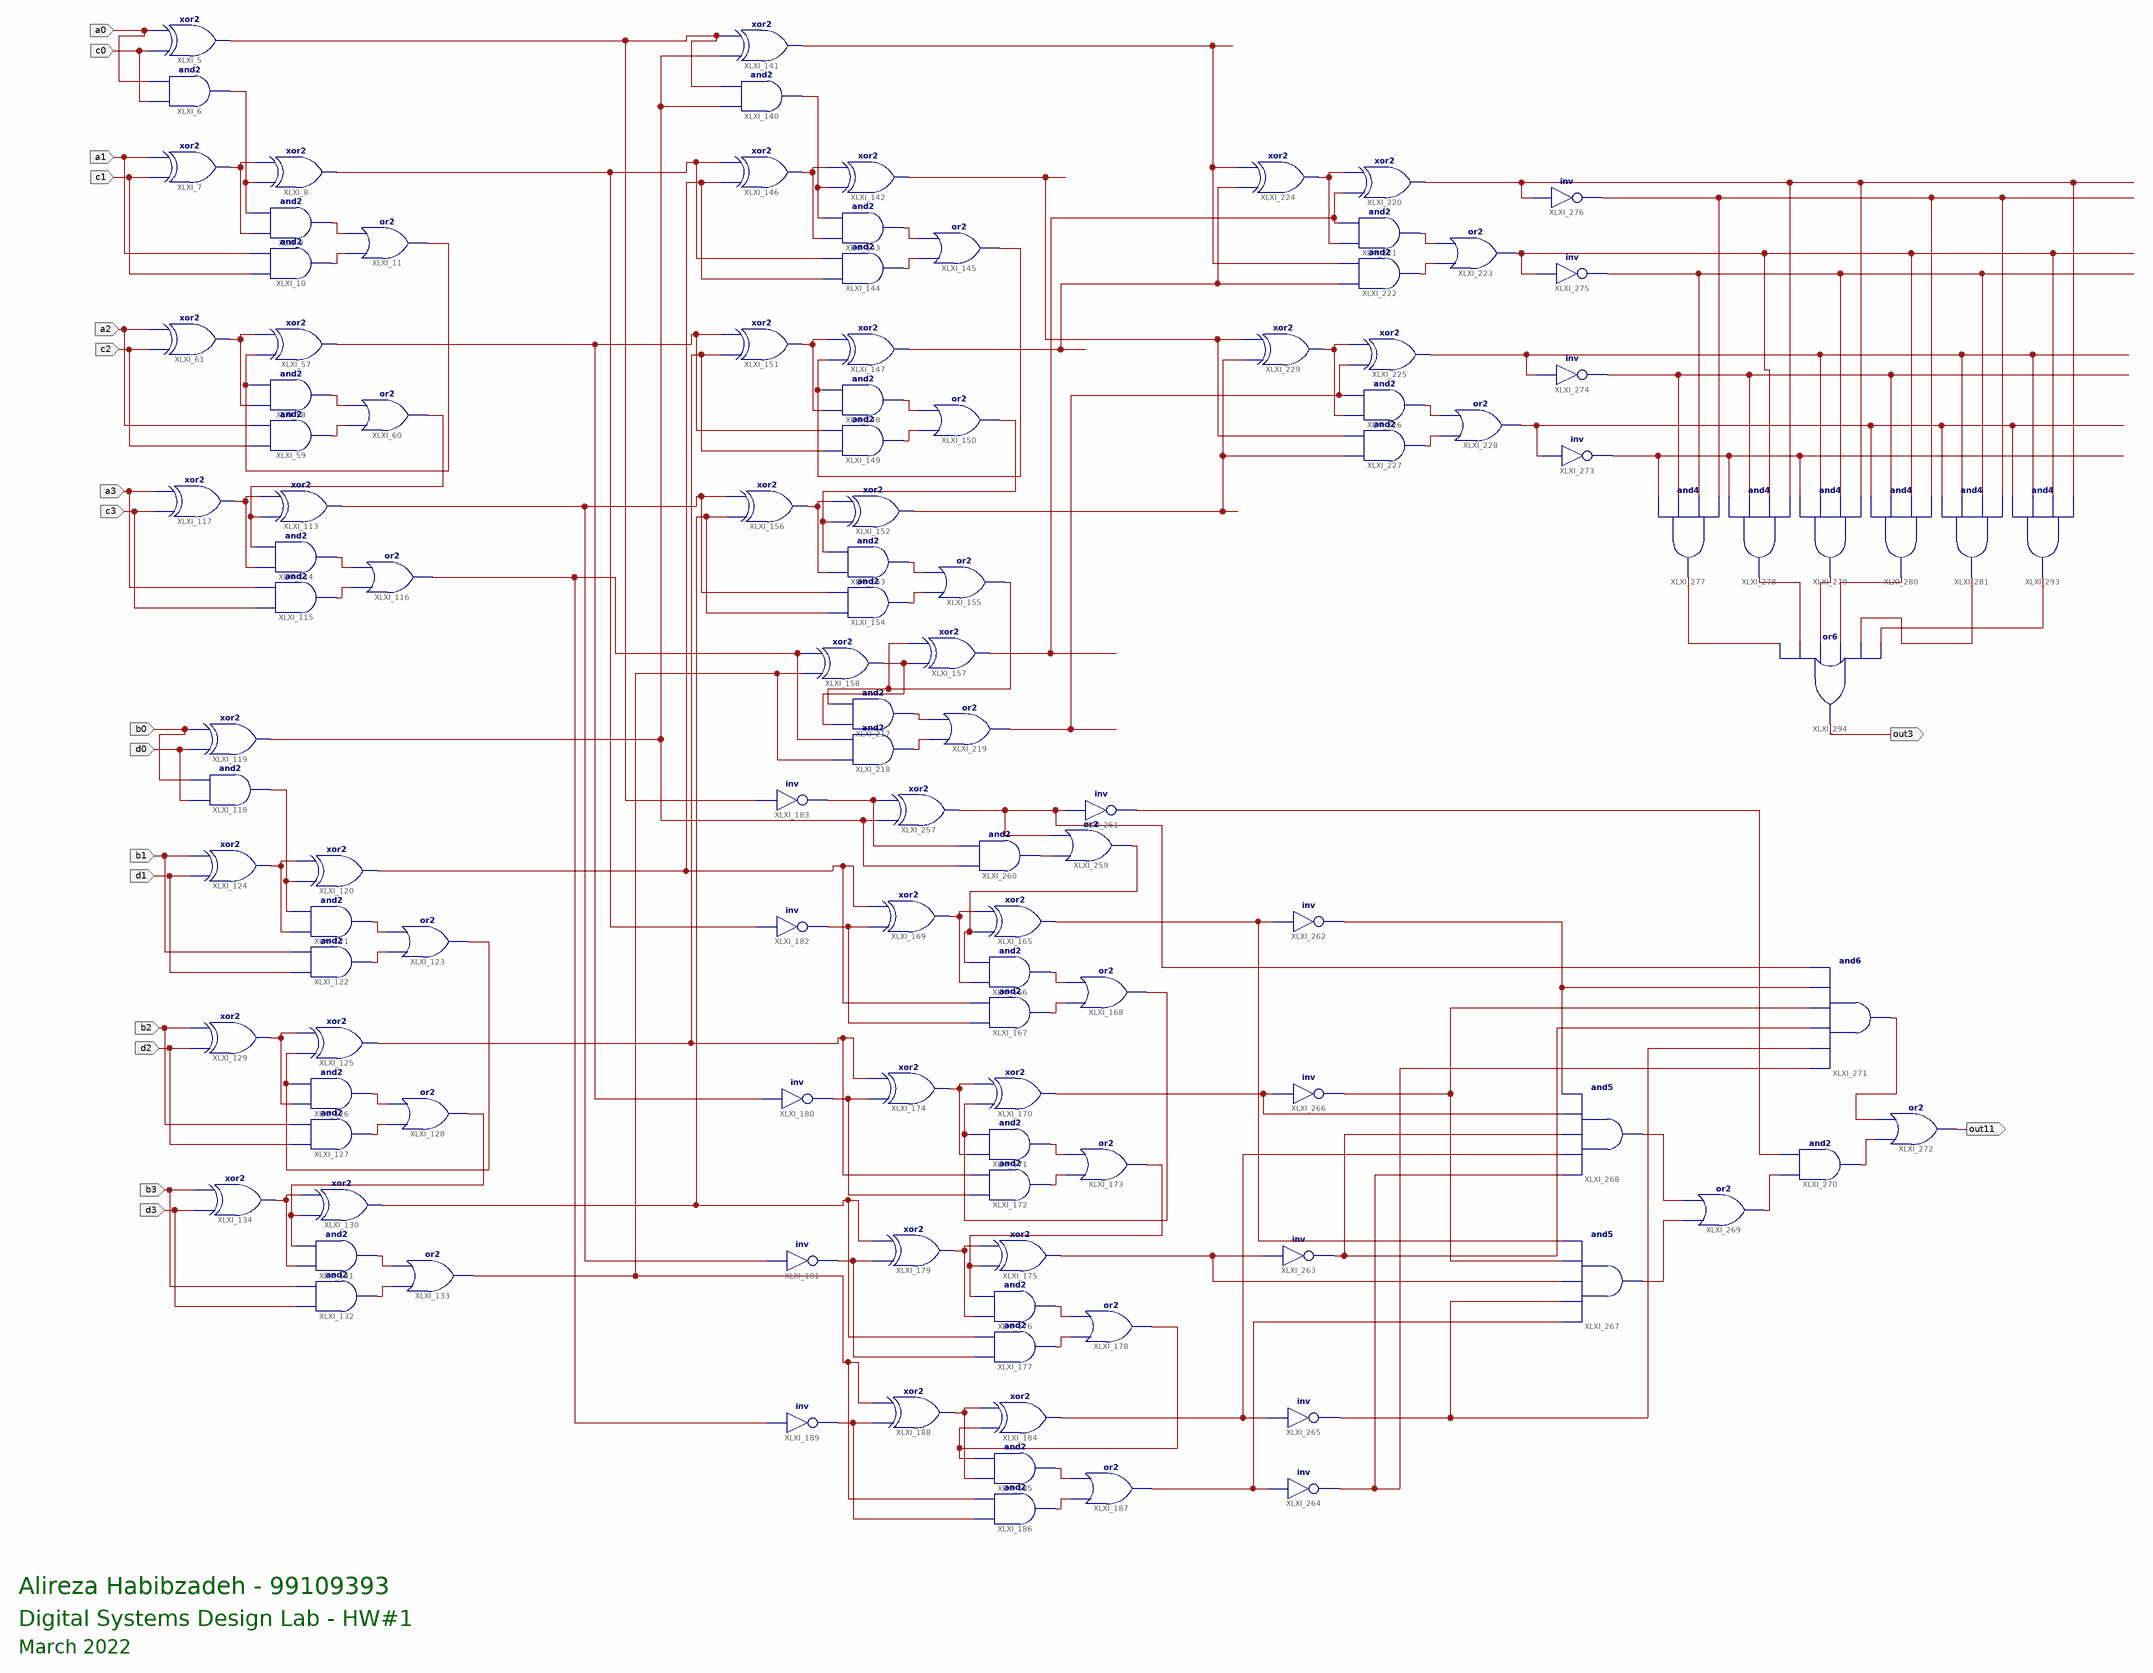
[diagram p0: schematic sheet 1]
// Xilinx ISE schematic bcd311.sch (spartan3) as structural Verilog: 117 symbols, 18 ports
module bcd311 (
  input  a0,
  input  c0,
  input  a1,
  input  c1,
  input  a2,
  input  c2,
  input  a3,
  input  c3,
  input  b0,
  input  d0,
  input  b1,
  input  d1,
  input  b2,
  input  d2,
  input  b3,
  input  d3,
  output out11,
  output out3
);

  wire s0, s1, s2, s3, s4, s5, XLXN_6, XLXN_7, XLXN_12, XLXN_13, XLXN_69, XLXN_71, XLXN_72, XLXN_74,
       XLXN_163, XLXN_165, XLXN_167, XLXN_170, XLXN_173, XLXN_175, XLXN_177, XLXN_178, XLXN_180, XLXN_182,
       XLXN_184, XLXN_189, XLXN_190, XLXN_192, XLXN_194, XLXN_198, XLXN_208, XLXN_210, XLXN_212, XLXN_213,
       XLXN_215, XLXN_217, XLXN_219, XLXN_221, XLXN_223, XLXN_224, XLXN_225, XLXN_227, XLXN_229, XLXN_231,
       XLXN_233, XLXN_247, XLXN_249, XLXN_251, XLXN_252, XLXN_254, XLXN_256, XLXN_258, XLXN_260, XLXN_262,
       XLXN_264, XLXN_266, XLXN_268, XLXN_270, XLXN_272, XLXN_273, XLXN_275, XLXN_277, XLXN_279, XLXN_280,
       XLXN_283, XLXN_284, XLXN_285, XLXN_286, XLXN_331, XLXN_332, XLXN_333, XLXN_334, XLXN_335, XLXN_336,
       XLXN_337, XLXN_339, XLXN_341, XLXN_345, XLXN_347, XLXN_349, XLXN_410, XLXN_411, XLXN_412, XLXN_417,
       XLXN_419, XLXN_420, XLXN_421, XLXN_422, XLXN_424, XLXN_426, XLXN_429, XLXN_432, XLXN_437, XLXN_441,
       XLXN_442, XLXN_444, XLXN_445, XLXN_446, XLXN_448, XLXN_449, XLXN_450, XLXN_838, XLXN_839, XLXN_840,
       XLXN_841, XLXN_849, XLXN_850, XLXN_851, XLXN_852, XLXN_855, XLXN_856, XLXN_857, XLXN_858, XLXN_867;

  and XLXI_6 (XLXN_12, c0, a0);
  xor XLXI_5 (XLXN_283, c0, a0);
  xor XLXI_8 (XLXN_284, XLXN_12, XLXN_13);
  and XLXI_9 (XLXN_6, XLXN_13, XLXN_12);
  and XLXI_10 (XLXN_7, c1, a1);
  or XLXI_11 (XLXN_72, XLXN_7, XLXN_6);
  xor XLXI_7 (XLXN_13, c1, a1);
  xor XLXI_57 (XLXN_285, XLXN_72, XLXN_74);
  and XLXI_58 (XLXN_69, XLXN_74, XLXN_72);
  and XLXI_59 (XLXN_71, c2, a2);
  or XLXI_60 (XLXN_170, XLXN_71, XLXN_69);
  xor XLXI_61 (XLXN_74, c2, a2);
  xor XLXI_113 (XLXN_286, XLXN_170, XLXN_167);
  and XLXI_114 (XLXN_163, XLXN_167, XLXN_170);
  and XLXI_115 (XLXN_165, c3, a3);
  or XLXI_116 (XLXN_335, XLXN_165, XLXN_163);
  xor XLXI_117 (XLXN_167, c3, a3);
  and XLXI_118 (XLXN_189, d0, b0);
  xor XLXI_119 (XLXN_411, d0, b0);
  xor XLXI_120 (XLXN_221, XLXN_189, XLXN_177);
  and XLXI_121 (XLXN_173, XLXN_177, XLXN_189);
  and XLXI_122 (XLXN_175, d1, b1);
  or XLXI_123 (XLXN_182, XLXN_175, XLXN_173);
  xor XLXI_124 (XLXN_177, d1, b1);
  xor XLXI_125 (XLXN_223, XLXN_182, XLXN_184);
  and XLXI_126 (XLXN_178, XLXN_184, XLXN_182);
  and XLXI_127 (XLXN_180, d2, b2);
  or XLXI_128 (XLXN_198, XLXN_180, XLXN_178);
  xor XLXI_129 (XLXN_184, d2, b2);
  xor XLXI_130 (XLXN_231, XLXN_198, XLXN_194);
  and XLXI_131 (XLXN_190, XLXN_194, XLXN_198);
  and XLXI_132 (XLXN_192, d3, b3);
  or XLXI_133 (XLXN_336, XLXN_192, XLXN_190);
  xor XLXI_134 (XLXN_194, d3, b3);
  and XLXI_140 (XLXN_224, XLXN_411, XLXN_283);
  xor XLXI_141 (s0, XLXN_411, XLXN_283);
  xor XLXI_142 (s1, XLXN_224, XLXN_212);
  and XLXI_143 (XLXN_208, XLXN_212, XLXN_224);
  and XLXI_144 (XLXN_210, XLXN_221, XLXN_284);
  or XLXI_145 (XLXN_217, XLXN_210, XLXN_208);
  xor XLXI_146 (XLXN_212, XLXN_221, XLXN_284);
  xor XLXI_147 (s2, XLXN_217, XLXN_219);
  and XLXI_148 (XLXN_213, XLXN_219, XLXN_217);
  and XLXI_149 (XLXN_215, XLXN_223, XLXN_285);
  or XLXI_150 (XLXN_233, XLXN_215, XLXN_213);
  xor XLXI_151 (XLXN_219, XLXN_223, XLXN_285);
  xor XLXI_152 (s3, XLXN_233, XLXN_229);
  and XLXI_153 (XLXN_225, XLXN_229, XLXN_233);
  and XLXI_154 (XLXN_227, XLXN_231, XLXN_286);
  or XLXI_155 (XLXN_331, XLXN_227, XLXN_225);
  xor XLXI_156 (XLXN_229, XLXN_231, XLXN_286);
  xor XLXI_157 (s4, XLXN_332, XLXN_331);
  xor XLXI_158 (XLXN_332, XLXN_336, XLXN_335);
  xor XLXI_165 (XLXN_442, XLXN_417, XLXN_251);
  and XLXI_166 (XLXN_247, XLXN_251, XLXN_417);
  and XLXI_167 (XLXN_249, XLXN_260, XLXN_221);
  or XLXI_168 (XLXN_256, XLXN_249, XLXN_247);
  xor XLXI_169 (XLXN_251, XLXN_260, XLXN_221);
  xor XLXI_170 (XLXN_432, XLXN_256, XLXN_258);
  and XLXI_171 (XLXN_252, XLXN_258, XLXN_256);
  and XLXI_172 (XLXN_254, XLXN_262, XLXN_223);
  or XLXI_173 (XLXN_272, XLXN_254, XLXN_252);
  xor XLXI_174 (XLXN_258, XLXN_262, XLXN_223);
  xor XLXI_175 (XLXN_444, XLXN_272, XLXN_268);
  and XLXI_176 (XLXN_264, XLXN_268, XLXN_272);
  and XLXI_177 (XLXN_266, XLXN_270, XLXN_231);
  or XLXI_178 (XLXN_280, XLXN_266, XLXN_264);
  xor XLXI_179 (XLXN_268, XLXN_270, XLXN_231);
  xor XLXI_184 (XLXN_429, XLXN_280, XLXN_277);
  and XLXI_185 (XLXN_273, XLXN_277, XLXN_280);
  and XLXI_186 (XLXN_275, XLXN_279, XLXN_336);
  or XLXI_187 (XLXN_446, XLXN_275, XLXN_273);
  xor XLXI_188 (XLXN_277, XLXN_279, XLXN_336);
  not XLXI_182 (XLXN_260, XLXN_284);
  not XLXI_180 (XLXN_262, XLXN_285);
  not XLXI_181 (XLXN_270, XLXN_286);
  not XLXI_189 (XLXN_279, XLXN_335);
  not XLXI_183 (XLXN_410, XLXN_283);
  and XLXI_217 (XLXN_333, XLXN_332, XLXN_331);
  and XLXI_218 (XLXN_334, XLXN_336, XLXN_335);
  or XLXI_219 (s5, XLXN_334, XLXN_333);
  xor XLXI_220 (XLXN_840, s4, XLXN_341);
  and XLXI_221 (XLXN_337, XLXN_341, s4);
  and XLXI_222 (XLXN_339, s2, s0);
  or XLXI_223 (XLXN_839, XLXN_339, XLXN_337);
  xor XLXI_224 (XLXN_341, s2, s0);
  xor XLXI_225 (XLXN_838, s5, XLXN_349);
  and XLXI_226 (XLXN_345, XLXN_349, s5);
  and XLXI_227 (XLXN_347, s3, s1);
  or XLXI_228 (XLXN_841, XLXN_347, XLXN_345);
  xor XLXI_229 (XLXN_349, s3, s1);
  xor XLXI_257 (XLXN_419, XLXN_411, XLXN_410);
  and XLXI_260 (XLXN_412, XLXN_411, XLXN_410);
  or XLXI_259 (XLXN_417, XLXN_412, XLXN_419);
  not XLXI_261 (XLXN_424, XLXN_419);
  not XLXI_263 (XLXN_437, XLXN_444);
  and XLXI_267 (XLXN_421, XLXN_446, XLXN_445, XLXN_444, XLXN_448, XLXN_442);
  and XLXI_268 (XLXN_420, XLXN_441, XLXN_429, XLXN_437, XLXN_432, XLXN_426);
  or XLXI_269 (XLXN_422, XLXN_421, XLXN_420);
  and XLXI_270 (XLXN_449, XLXN_422, XLXN_424);
  not XLXI_262 (XLXN_426, XLXN_442);
  not XLXI_266 (XLXN_448, XLXN_432);
  not XLXI_265 (XLXN_445, XLXN_429);
  not XLXI_264 (XLXN_441, XLXN_446);
  and XLXI_271 (XLXN_450, XLXN_441, XLXN_445, XLXN_437, XLXN_448, XLXN_426, XLXN_419);
  or XLXI_272 (out11, XLXN_449, XLXN_450);
  not XLXI_273 (XLXN_852, XLXN_841);
  not XLXI_274 (XLXN_851, XLXN_838);
  not XLXI_275 (XLXN_850, XLXN_839);
  not XLXI_276 (XLXN_849, XLXN_840);
  and XLXI_277 (XLXN_855, XLXN_852, XLXN_851, XLXN_850, XLXN_849);
  and XLXI_278 (XLXN_856, XLXN_852, XLXN_851, XLXN_839, XLXN_840);
  and XLXI_279 (XLXN_857, XLXN_852, XLXN_838, XLXN_850, XLXN_840);
  and XLXI_280 (XLXN_858, XLXN_841, XLXN_851, XLXN_839, XLXN_849);
  and XLXI_281 (XLXN_867, XLXN_841, XLXN_838, XLXN_850, XLXN_849);
  and XLXI_293 (XLXN_867, XLXN_841, XLXN_838, XLXN_839, XLXN_840);
  or XLXI_294 (out3, XLXN_855, XLXN_856, XLXN_857, XLXN_858, XLXN_867, XLXN_867);

  // Notes on the sheet:
  //   Alireza Habibzadeh - 99109393
  //   Digital Systems Design Lab - HW#1
  //   March 2022
endmodule
